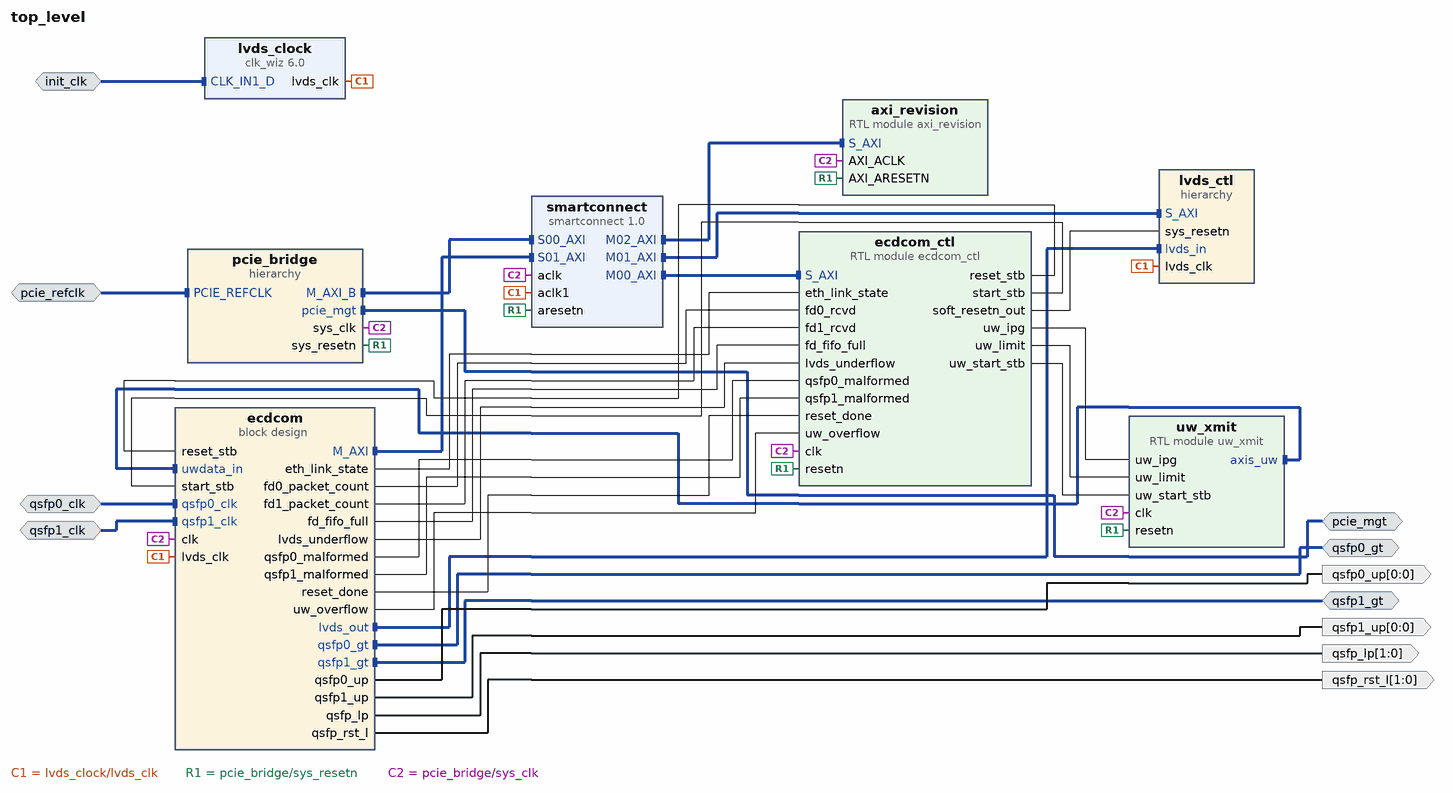
[diagram p0: block diagram of the top level]
# Vivado block design top_level, xcku15p-ffve1517-3-e, Vivado 2024.2
create_bd_design top_level

create_bd_intf_port -mode Slave -vlnv xilinx.com:interface:diff_clock_rtl:1.0 pcie_refclk
create_bd_intf_port -mode Master -vlnv xilinx.com:interface:pcie_7x_mgt_rtl:1.0 pcie_mgt
create_bd_intf_port -mode Master -vlnv xilinx.com:interface:gt_rtl:1.0 qsfp0_gt
create_bd_intf_port -mode Slave -vlnv xilinx.com:interface:diff_clock_rtl:1.0 qsfp0_clk
set_property -dict {CONFIG.FREQ_HZ 322265625} [get_bd_intf_ports qsfp0_clk]
create_bd_intf_port -mode Master -vlnv xilinx.com:interface:gt_rtl:1.0 qsfp1_gt
create_bd_intf_port -mode Slave -vlnv xilinx.com:interface:diff_clock_rtl:1.0 qsfp1_clk
set_property -dict {CONFIG.FREQ_HZ 322265625} [get_bd_intf_ports qsfp1_clk]
create_bd_intf_port -mode Slave -vlnv xilinx.com:interface:diff_clock_rtl:1.0 init_clk
set_property -dict {CONFIG.FREQ_HZ 200000000} [get_bd_intf_ports init_clk]
create_bd_port -dir O -from 0 -to 0 qsfp0_up
create_bd_port -dir O -from 0 -to 0 qsfp1_up
create_bd_port -dir O -from 1 -to 0 qsfp_rst_l
create_bd_port -dir O -from 1 -to 0 qsfp_lp

create_bd_cell -type hier pcie_bridge
create_bd_cell -type ip -vlnv xilinx.com:ip:smartconnect:1.0 smartconnect
set_property -dict {CONFIG.NUM_CLKS 2 CONFIG.NUM_MI 3 CONFIG.NUM_SI 2} [get_bd_cells smartconnect]
create_bd_cell -type ip -vlnv xilinx.com:ip:clk_wiz:6.0 lvds_clock
set_property -dict [list \
  CONFIG.CLKOUT1_JITTER 93.529 \
  CONFIG.CLKOUT1_REQUESTED_OUT_FREQ 192.00 \
  CONFIG.CLK_OUT1_PORT lvds_clk \
  CONFIG.MMCM_CLKOUT0_DIVIDE_F 6.250 \
  CONFIG.PRIM_SOURCE Differential_clock_capable_pin \
  CONFIG.USE_LOCKED false \
  CONFIG.USE_RESET false \
] [get_bd_cells lvds_clock]
create_bd_cell -type module -reference ecdcom_ctl ecdcom_ctl
create_bd_cell -type module -reference uw_xmit uw_xmit
create_bd_cell -type hier lvds_ctl
create_bd_cell -type container -reference ecdcom ecdcom
set_property -dict [list \
  CONFIG.ACTIVE_SIM_BD ecdcom.bd \
  CONFIG.ACTIVE_SYNTH_BD ecdcom.bd \
  CONFIG.ENABLE_DFX 0 \
  CONFIG.LIST_SIM_BD ecdcom.bd \
  CONFIG.LIST_SYNTH_BD ecdcom.bd \
  CONFIG.LOCK_PROPAGATE 0 \
] [get_bd_cells ecdcom]
create_bd_cell -type module -reference axi_revision axi_revision

# ---- hierarchy /pcie_bridge ----
current_bd_instance /pcie_bridge
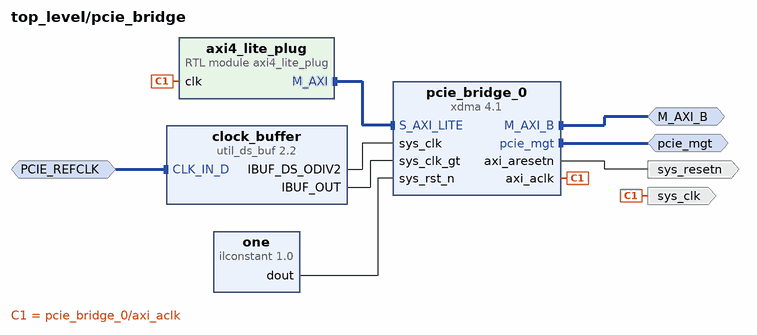
[diagram p1: block diagram inside /pcie_bridge]
create_bd_intf_pin -mode Slave -vlnv xilinx.com:interface:diff_clock_rtl:1.0 PCIE_REFCLK
create_bd_intf_pin -mode Master -vlnv xilinx.com:interface:pcie_7x_mgt_rtl:1.0 pcie_mgt
create_bd_intf_pin -mode Master -vlnv xilinx.com:interface:aximm_rtl:1.0 M_AXI_B
create_bd_pin -dir O -type rst sys_resetn
create_bd_pin -dir O -type clk sys_clk

create_bd_cell -type ip -vlnv xilinx.com:ip:util_ds_buf:2.2 clock_buffer
set_property -dict {CONFIG.C_BUF_TYPE IBUFDSGTE} [get_bd_cells clock_buffer]
create_bd_cell -type module -reference axi4_lite_plug axi4_lite_plug
create_bd_cell -type ip -vlnv xilinx.com:ip:xdma:4.1 pcie_bridge_0
set_property -dict [list \
  CONFIG.PF0_DEVICE_ID_mqdma 903F \
  CONFIG.PF0_SRIOV_VF_DEVICE_ID A03F \
  CONFIG.PF2_DEVICE_ID_mqdma 923F \
  CONFIG.PF3_DEVICE_ID_mqdma 933F \
  CONFIG.axi_addr_width 64 \
  CONFIG.axi_data_width 512_bit \
  CONFIG.axisten_freq 250 \
  CONFIG.bridge_burst true \
  CONFIG.en_axi_slave_if false \
  CONFIG.en_gt_selection false \
  CONFIG.functional_mode AXI_Bridge \
  CONFIG.mode_selection Advanced \
  CONFIG.pcie_blk_locn X0Y3 \
  CONFIG.pf0_bar0_scale Megabytes \
  CONFIG.pf0_bar0_size 1 \
  CONFIG.pf0_device_id 903F \
  CONFIG.pf0_msi_enabled false \
  CONFIG.pl_link_cap_max_link_speed 8.0_GT/s \
  CONFIG.pl_link_cap_max_link_width X16 \
  CONFIG.runbit_fix false \
  CONFIG.xlnx_ref_board None \
] [get_bd_cells pcie_bridge_0]
create_bd_cell -type inline_hdl -vlnv xilinx.com:inline_hdl:ilconstant:1.0 one

# ---- hierarchy /lvds_ctl ----
current_bd_instance /lvds_ctl
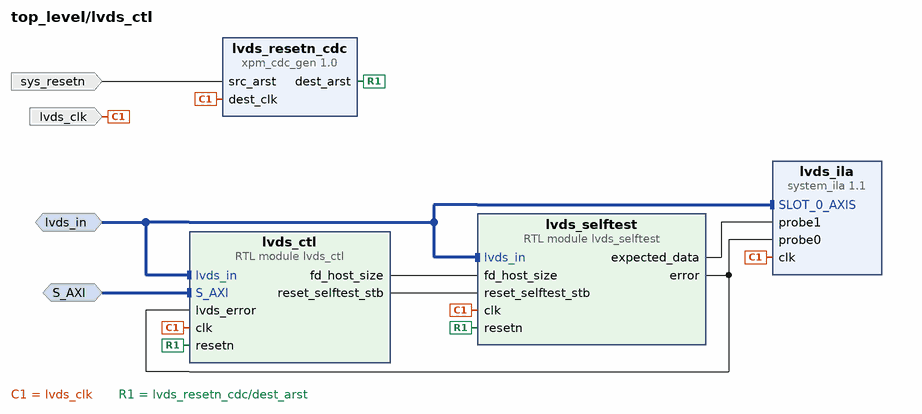
[diagram p2: block diagram inside /lvds_ctl]
create_bd_intf_pin -mode Slave -vlnv xilinx.com:interface:axis_rtl:1.0 lvds_in
create_bd_intf_pin -mode Slave -vlnv xilinx.com:interface:aximm_rtl:1.0 S_AXI
create_bd_pin -dir I -type clk lvds_clk
create_bd_pin -dir I sys_resetn

create_bd_cell -type ip -vlnv xilinx.com:ip:xpm_cdc_gen:1.0 lvds_resetn_cdc
set_property -dict {CONFIG.CDC_TYPE xpm_cdc_async_rst} [get_bd_cells lvds_resetn_cdc]
create_bd_cell -type module -reference lvds_ctl lvds_ctl
create_bd_cell -type ip -vlnv xilinx.com:ip:system_ila:1.1 lvds_ila
set_property -dict [list \
  CONFIG.C_MON_TYPE MIX \
  CONFIG.C_NUM_OF_PROBES 2 \
  CONFIG.C_SLOT_0_INTF_TYPE xilinx.com:interface:axis_rtl:1.0 \
] [get_bd_cells lvds_ila]
create_bd_cell -type module -reference lvds_selftest lvds_selftest

# ---- connections ----

current_bd_instance /pcie_bridge
connect_bd_intf_net -intf_net CLK_IN_D_0_1 [get_bd_intf_pins PCIE_REFCLK] [get_bd_intf_pins clock_buffer/CLK_IN_D]
connect_bd_intf_net [get_bd_intf_pins pcie_bridge_0/pcie_mgt] [get_bd_intf_pins pcie_mgt]
connect_bd_intf_net [get_bd_intf_pins pcie_bridge_0/M_AXI_B] [get_bd_intf_pins M_AXI_B]
connect_bd_intf_net [get_bd_intf_pins axi4_lite_plug/M_AXI] [get_bd_intf_pins pcie_bridge_0/S_AXI_LITE]
connect_bd_net [get_bd_pins clock_buffer/IBUF_DS_ODIV2] [get_bd_pins pcie_bridge_0/sys_clk]
connect_bd_net [get_bd_pins clock_buffer/IBUF_OUT] [get_bd_pins pcie_bridge_0/sys_clk_gt]
connect_bd_net [get_bd_pins one/dout] [get_bd_pins pcie_bridge_0/sys_rst_n]
connect_bd_net [get_bd_pins pcie_bridge_0/axi_aclk] [get_bd_pins sys_clk] [get_bd_pins axi4_lite_plug/clk]
connect_bd_net [get_bd_pins pcie_bridge_0/axi_aresetn] [get_bd_pins sys_resetn]

current_bd_instance /lvds_ctl
connect_bd_intf_net -intf_net ecdcom_lvds_out [get_bd_intf_pins lvds_in] [get_bd_intf_pins lvds_ctl/lvds_in]
connect_bd_intf_net [get_bd_intf_pins lvds_in] [get_bd_intf_pins lvds_ila/SLOT_0_AXIS]
connect_bd_intf_net [get_bd_intf_pins lvds_in] [get_bd_intf_pins lvds_selftest/lvds_in]
connect_bd_intf_net -intf_net smartconnect_M01_AXI [get_bd_intf_pins S_AXI] [get_bd_intf_pins lvds_ctl/S_AXI]
connect_bd_net -net lvds_clock_lvds_clk [get_bd_pins lvds_clk] \
  [get_bd_pins lvds_resetn_cdc/dest_clk] [get_bd_pins lvds_ila/clk] [get_bd_pins lvds_selftest/clk] \
  [get_bd_pins lvds_ctl/clk]
connect_bd_net [get_bd_pins lvds_ctl/fd_host_size] [get_bd_pins lvds_selftest/fd_host_size]
connect_bd_net [get_bd_pins lvds_ctl/reset_selftest_stb] [get_bd_pins lvds_selftest/reset_selftest_stb]
connect_bd_net -net lvds_selftest_0_error [get_bd_pins lvds_selftest/error] [get_bd_pins lvds_ila/probe0] [get_bd_pins lvds_ctl/lvds_error]
connect_bd_net [get_bd_pins lvds_selftest/expected_data] [get_bd_pins lvds_ila/probe1]
connect_bd_net -net pcie_bridge_0_axi_aresetn [get_bd_pins sys_resetn] [get_bd_pins lvds_resetn_cdc/src_arst]
connect_bd_net -net xpm_cdc_gen_0_dest_arst [get_bd_pins lvds_resetn_cdc/dest_arst] [get_bd_pins lvds_selftest/resetn] [get_bd_pins lvds_ctl/resetn]

current_bd_instance /
connect_bd_intf_net -intf_net CLK_IN_D_0_1 [get_bd_intf_ports pcie_refclk] [get_bd_intf_pins pcie_bridge/PCIE_REFCLK]
connect_bd_intf_net [get_bd_intf_pins smartconnect/S01_AXI] [get_bd_intf_pins ecdcom/M_AXI]
connect_bd_intf_net [get_bd_intf_pins lvds_ctl/lvds_in] [get_bd_intf_pins ecdcom/lvds_out]
connect_bd_intf_net [get_bd_intf_ports qsfp0_gt] [get_bd_intf_pins ecdcom/qsfp0_gt]
connect_bd_intf_net [get_bd_intf_ports qsfp1_gt] [get_bd_intf_pins ecdcom/qsfp1_gt]
connect_bd_intf_net [get_bd_intf_pins lvds_clock/CLK_IN1_D] [get_bd_intf_ports init_clk]
connect_bd_intf_net [get_bd_intf_pins smartconnect/S00_AXI] [get_bd_intf_pins pcie_bridge/M_AXI_B]
connect_bd_intf_net [get_bd_intf_ports pcie_mgt] [get_bd_intf_pins pcie_bridge/pcie_mgt]
connect_bd_intf_net [get_bd_intf_ports qsfp0_clk] [get_bd_intf_pins ecdcom/qsfp0_clk]
connect_bd_intf_net [get_bd_intf_ports qsfp1_clk] [get_bd_intf_pins ecdcom/qsfp1_clk]
connect_bd_intf_net [get_bd_intf_pins ecdcom_ctl/S_AXI] [get_bd_intf_pins smartconnect/M00_AXI]
connect_bd_intf_net [get_bd_intf_pins lvds_ctl/S_AXI] [get_bd_intf_pins smartconnect/M01_AXI]
connect_bd_intf_net [get_bd_intf_pins axi_revision/S_AXI] [get_bd_intf_pins smartconnect/M02_AXI]
connect_bd_intf_net [get_bd_intf_pins uw_xmit/axis_uw] [get_bd_intf_pins ecdcom/uwdata_in]
connect_bd_net -net ecdcom_ctl_0_reset_stb [get_bd_pins ecdcom_ctl/reset_stb] [get_bd_pins ecdcom/reset_stb]
connect_bd_net -net ecdcom_ctl_0_start_stb [get_bd_pins ecdcom_ctl/start_stb] [get_bd_pins ecdcom/start_stb]
connect_bd_net [get_bd_pins ecdcom_ctl/soft_resetn_out] [get_bd_pins lvds_ctl/sys_resetn]
connect_bd_net [get_bd_pins ecdcom_ctl/uw_ipg] [get_bd_pins uw_xmit/uw_ipg]
connect_bd_net [get_bd_pins ecdcom_ctl/uw_limit] [get_bd_pins uw_xmit/uw_limit]
connect_bd_net [get_bd_pins ecdcom_ctl/uw_start_stb] [get_bd_pins uw_xmit/uw_start_stb]
connect_bd_net [get_bd_pins ecdcom/eth_link_state] [get_bd_pins ecdcom_ctl/eth_link_state]
connect_bd_net [get_bd_pins ecdcom/fd0_packet_count] [get_bd_pins ecdcom_ctl/fd0_rcvd]
connect_bd_net [get_bd_pins ecdcom/fd1_packet_count] [get_bd_pins ecdcom_ctl/fd1_rcvd]
connect_bd_net [get_bd_pins ecdcom/fd_fifo_full] [get_bd_pins ecdcom_ctl/fd_fifo_full]
connect_bd_net [get_bd_pins ecdcom/lvds_underflow] [get_bd_pins ecdcom_ctl/lvds_underflow]
connect_bd_net [get_bd_pins ecdcom/qsfp0_malformed] [get_bd_pins ecdcom_ctl/qsfp0_malformed]
connect_bd_net [get_bd_pins ecdcom/qsfp0_up] [get_bd_ports qsfp0_up]
connect_bd_net [get_bd_pins ecdcom/qsfp1_malformed] [get_bd_pins ecdcom_ctl/qsfp1_malformed]
connect_bd_net [get_bd_pins ecdcom/qsfp1_up] [get_bd_ports qsfp1_up]
connect_bd_net [get_bd_pins ecdcom/qsfp_lp] [get_bd_ports qsfp_lp]
connect_bd_net [get_bd_pins ecdcom/qsfp_rst_l] [get_bd_ports qsfp_rst_l]
connect_bd_net [get_bd_pins ecdcom/reset_done] [get_bd_pins ecdcom_ctl/reset_done]
connect_bd_net [get_bd_pins ecdcom/uw_overflow] [get_bd_pins ecdcom_ctl/uw_overflow]
connect_bd_net [get_bd_pins lvds_clock/lvds_clk] [get_bd_pins smartconnect/aclk1] [get_bd_pins lvds_ctl/lvds_clk] [get_bd_pins ecdcom/lvds_clk]
connect_bd_net -net pcie_bridge_0_axi_aresetn [get_bd_pins pcie_bridge/sys_resetn] \
  [get_bd_pins smartconnect/aresetn] [get_bd_pins uw_xmit/resetn] [get_bd_pins ecdcom_ctl/resetn] \
  [get_bd_pins axi_revision/AXI_ARESETN]
connect_bd_net -net pcie_bridge_axi_aclk_0 [get_bd_pins pcie_bridge/sys_clk] \
  [get_bd_pins smartconnect/aclk] [get_bd_pins uw_xmit/clk] [get_bd_pins ecdcom/clk] [get_bd_pins ecdcom_ctl/clk] \
  [get_bd_pins axi_revision/AXI_ACLK]

# ---- address map ----
assign_bd_address -offset 0x00000000 -range 4K -target_address_space [get_bd_addr_spaces ecdcom/ecdcom_axis_axi_serv/M_AXI] [get_bd_addr_segs axi_revision/S_AXI/reg0]
assign_bd_address -offset 0x00001000 -range 4K -target_address_space [get_bd_addr_spaces ecdcom/ecdcom_axis_axi_serv/M_AXI] [get_bd_addr_segs ecdcom_ctl/S_AXI/reg0]
assign_bd_address -offset 0x00002000 -range 4K -target_address_space [get_bd_addr_spaces ecdcom/ecdcom_axis_axi_serv/M_AXI] [get_bd_addr_segs lvds_ctl/lvds_ctl/S_AXI/reg0]
assign_bd_address -offset 0x00000000 -range 512M -target_address_space [get_bd_addr_spaces pcie_bridge/axi4_lite_plug/M_AXI] [get_bd_addr_segs pcie_bridge/pcie_bridge_0/S_AXI_LITE/CTL0]
assign_bd_address -offset 0x0000000000000000 -range 4K -target_address_space [get_bd_addr_spaces pcie_bridge/pcie_bridge_0/M_AXI_B] [get_bd_addr_segs axi_revision/S_AXI/reg0]
assign_bd_address -offset 0x0000000000001000 -range 4K -target_address_space [get_bd_addr_spaces pcie_bridge/pcie_bridge_0/M_AXI_B] [get_bd_addr_segs ecdcom_ctl/S_AXI/reg0]
assign_bd_address -offset 0x0000000000002000 -range 4K -target_address_space [get_bd_addr_spaces pcie_bridge/pcie_bridge_0/M_AXI_B] [get_bd_addr_segs lvds_ctl/lvds_ctl/S_AXI/reg0]

validate_bd_design
save_bd_design
